# Altium project nvs.PrjPcb
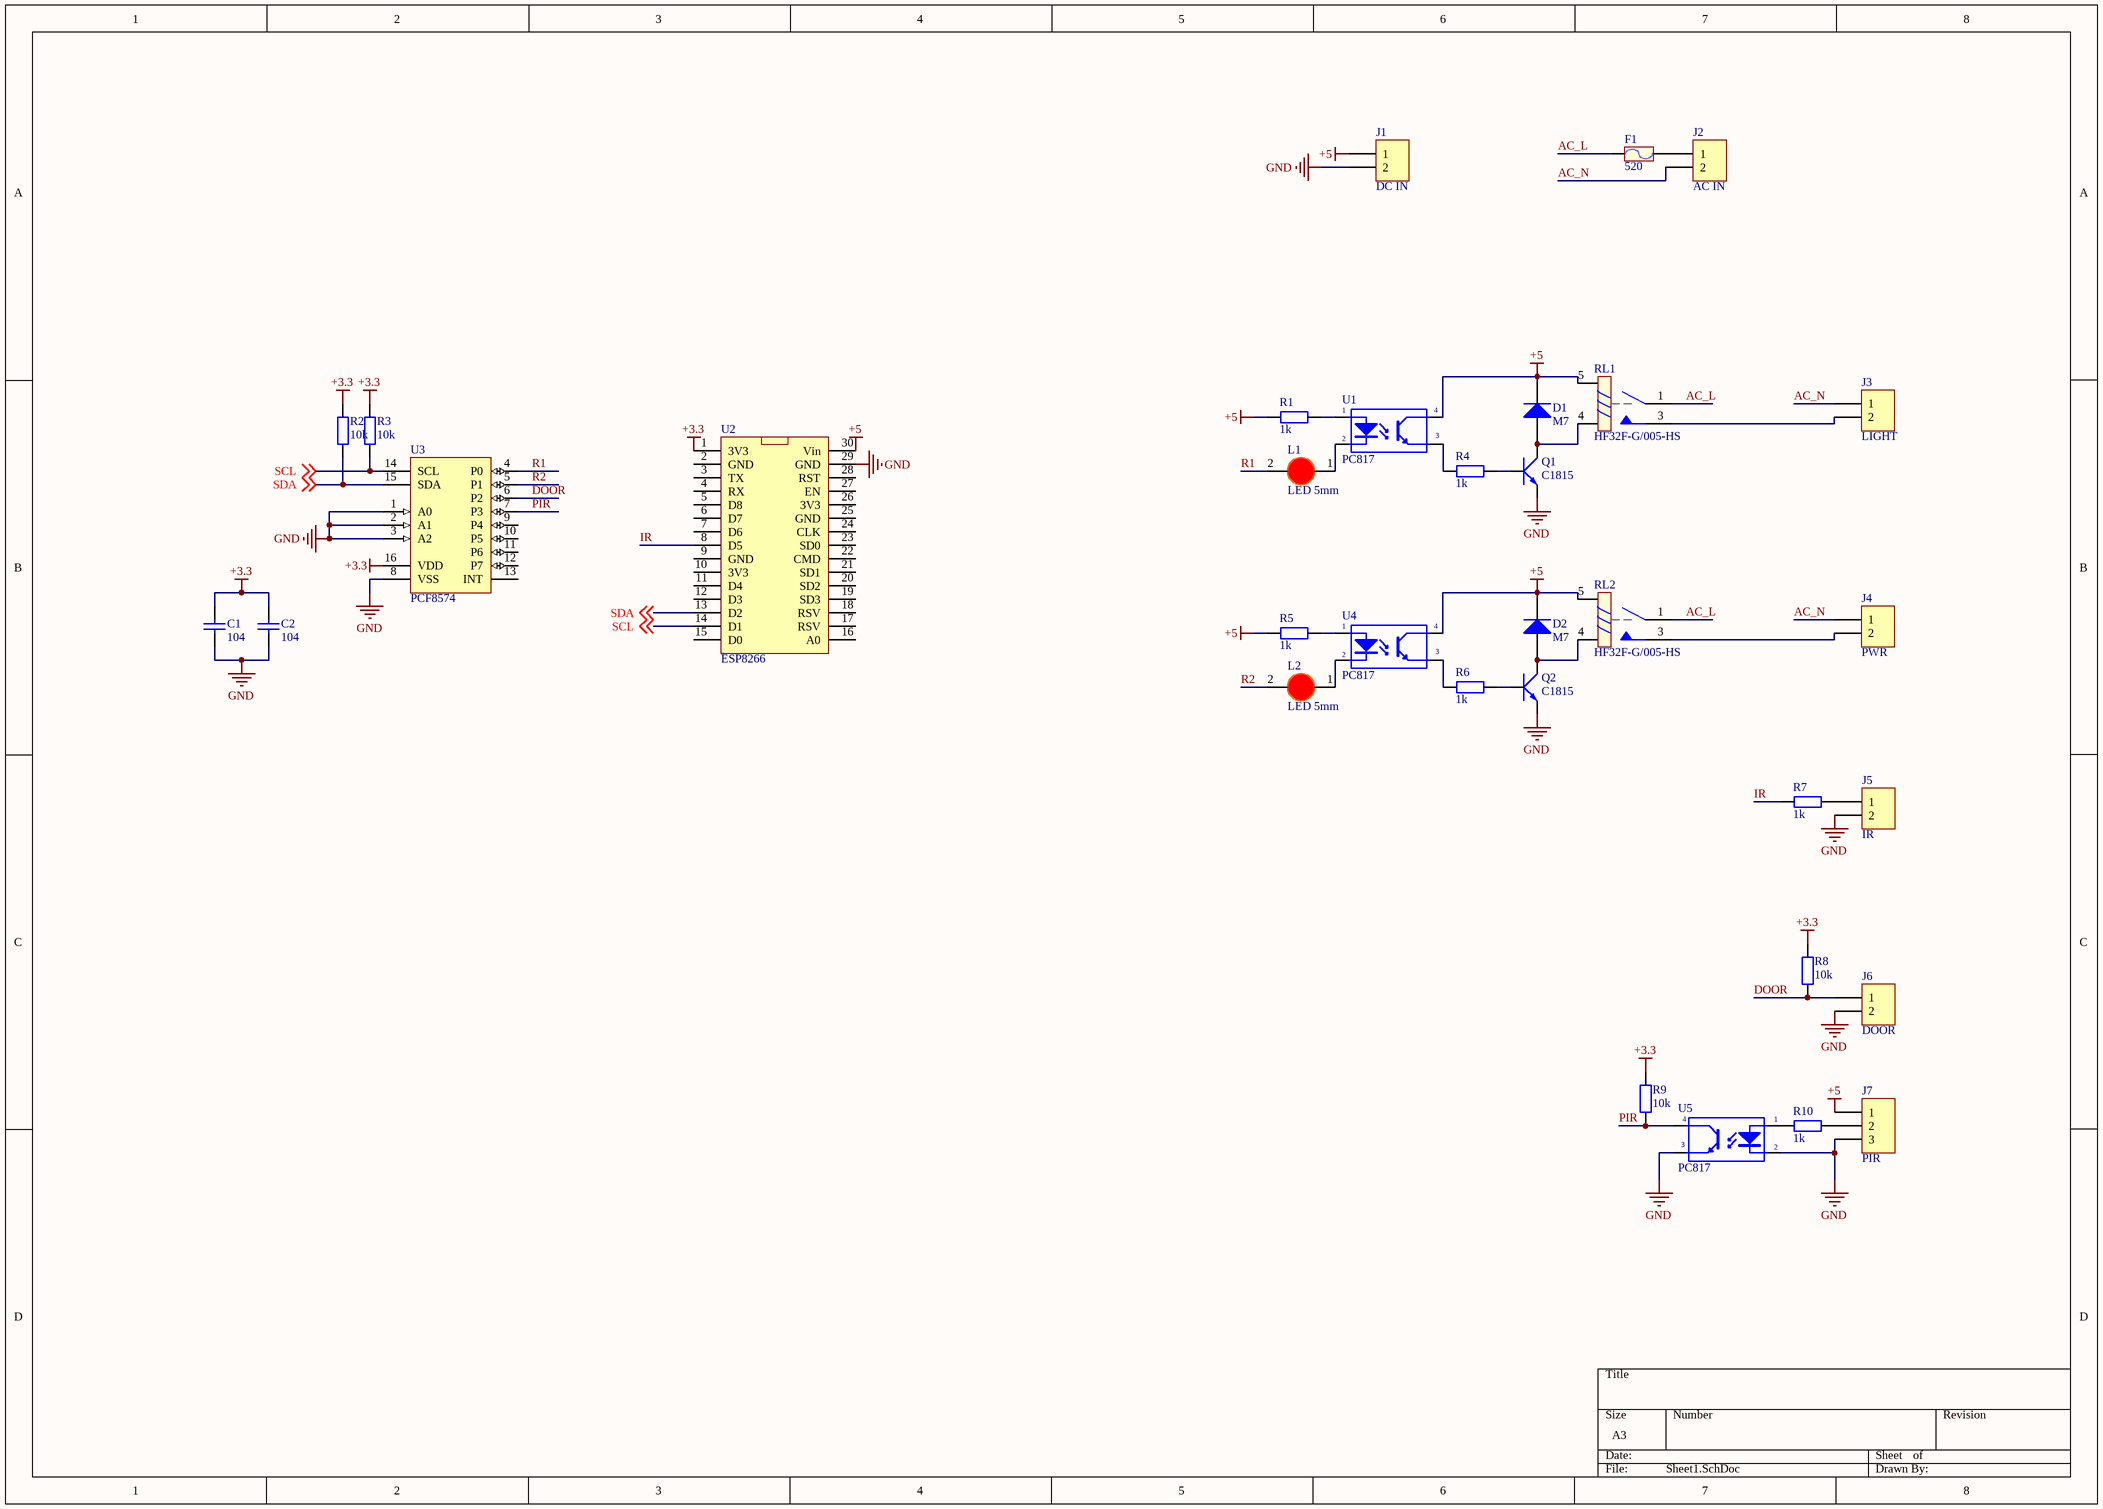
[diagram p0: Sheet1.SchDoc]
1 sheet, 33 parts. Net scope: global (net labels, ports and power ports of the same name join across sheets).
Board file: PCB1.PcbDoc

## Sheet Sheet1.SchDoc
size A3; SheetNumber: 1; SheetTotal: 1

### Parts
C1  104  [tu 0805]
C2  104  [tu 0805]
D1  M7  [DIODE SMA]
D2  M7  [DIODE SMA]
F1  520  [De Cau Chi 520 630]
J1  DC IN  [CON 2 HT3.96]
J2  AC IN  [CON 2 2EDG5.08 B]
J3  LIGHT  [CON 2 2EDG5.08 B]
J4  PWR  [CON 2 2EDG5.08 B]
J5  IR  [CON 2 HT3.96]
J6  DOOR  [CON 2 HT3.96]
J7  PIR  [KF3-3.96]
L1  LED 5mm  [LED-5MM-RED]
L2  LED 5mm  [LED-5MM-RED]
Q1  C1815  [TO92]
Q2  C1815  [TO92]
R1  1k  [tro smd 0805]
R2  10k  [tro smd 0805]
R3  10k  [tro smd 0805]
R4  1k  [tro smd 0805]
R5  1k  [tro smd 0805]
R6  1k  [tro smd 0805]
R7  1k  [tro smd 0805]
R8  10k  [tro smd 0805]
R9  10k  [tro smd 0805]
R10  1k  [tro smd 0805]
RL1  HF32F-G/005-HS  [HF32F-G]
RL2  HF32F-G/005-HS  [HF32F-G]
U1  PC817  [DIP4]
U2  ESP8266  [NODE MCU CH340]
U3  PCF8574  [DIP16]
U4  PC817  [DIP4]
U5  PC817  [DIP4]

### Nets
+3.3: C1.1 C2.1 R2.2 R3.2 R8.2 R9.2 U2.1(3V3) U3.16(VDD)
+5: D1.2(K) D2.2(K) J1.1 J7.1 R1.1 R5.1 RL1.5 RL2.5 U1.4(C) U2.30(Vin) U4.4(C)
GND: C1.2 C2.2 J1.2 J5.2 J6.2 J7.3 Q1.1(E) Q2.1(E) U2.29(GND) U3.1(A0) U3.2(A1) U3.3(A2) U3.8(VSS) U5.2(K) U5.3(E)
AC_L: F1.1 RL1.1 RL2.1
AC_N: J2.2 J3.1 J4.1
DOOR: J6.1 R8.1 U3.6(P2)
IR: R7.1 U2.8(D5)
PIR: R9.1 U3.7(P3) U5.4(C)
R1: L1.2(K) U3.4(P0)
R2: L2.2(K) U3.5(P1)
SCL: R3.1 U2.14(D1) U3.14(SCL) ; off-sheet SCL
SDA: R2.1 U2.13(D2) U3.15(SDA) ; off-sheet SDA
NetD1_1: D1.1(A) Q1.2(C) RL1.4
NetD2_1: D2.1(A) Q2.2(C) RL2.4
NetF1_2: F1.2 J2.1
NetJ3_2: J3.2 RL1.3
NetJ4_2: J4.2 RL2.3
NetJ5_1: J5.1 R7.2
NetJ7_2: J7.2 R10.1
NetL1_1: L1.1(A) U1.2(K)
NetL2_1: L2.1(A) U4.2(K)
NetQ1_3: Q1.3(B) R4.2
NetQ2_3: Q2.3(B) R6.2
NetR1_2: R1.2 U1.1(A)
NetR4_1: R4.1 U1.3(E)
NetR5_2: R5.2 U4.1(A)
NetR6_1: R6.1 U4.3(E)
NetR10_2: R10.2 U5.1(A)

Not connected (* = marked no-connect by the designer): U2 2(GND) 3(TX) 4(RX) 5(D8) 6(D7) 7(D6) 9(GND) 10(3V3) 11(D4) 12(D3) 15(D0) 16(A0) 17(RSV) 18(RSV) 19(SD3) 20(SD2) 21(SD1) 22(CMD) 23(SD0) 24(CLK) 25(GND) 26(3V3) 27(EN) 28(RST); U3 9(P4) 10(P5) 11(P6) 12(P7) 13(INT)

### Library data of the parts
C1 C2 = Tu 0805 104 50V 10%: Dán; Don_Vi: Con; So_Chan: 2; Ten_Linh_Kien: Tụ 0805 104-100nF 10% 50V; Ma_Hang: MH004551; Chung_Loai: Dán; Kieu_Chan: *
D1 D2 = Diode M7 ( 4007 ): Dán; Ten_Linh_Kien: Diode M7 1N4007 SMD 1A 1000V; Don_Vi: Con; Ma_Hang: MH000944; Chung_Loai: Dán; Ghi_Chu: *
F1 = De Cau Chi 520 630: 5x20mm; Ma_Hang: MH001473; Ten: Đế Cầu Chì 5x20MM 6x30MM SMD01
J1-J6 = CON 2 EDG5.08: CON2 KF terminal
J7 = CON 3 EDG: CON3 KF terminal
L1 L2 = LED 5mm Do: Cắm; Don_Vi: Con; Ma_Hang: MH008967; Ten_Linh_Kien: Led 5MM Phủ Đỏ (1000c); Ghi_Chu: *; Kieu_Chan: *; Chung_Loai: Cắm
Q1 Q2 = Trans C1815 DIP: NPN transistor; Value: C9014
R1 R4-R7 R10 = Tro 0805 1% 1k: Dán; Don_Vi: Con; So_Chan: 2; Ten_Linh_Kien: Trở 0805 1% 1k; Ma_Hang: MH005468; Chung_Loai: Dán; Kieu_Chan: *
R2 R3 R8 R9 = Tro 0805 1% 10k: Dán; Don_Vi: Con; So_Chan: 2; Ten_Linh_Kien: Trở 0805 1% 10k; Ma_Hang: MH005473; Chung_Loai: Dán; Kieu_Chan: *
RL1 RL2 = Relay HF 10A: Relay hongfa 10A 4P HF32F-G/005-HS
U1 U4 U5 = PC817: Single Opto; Value: PC817
U2 = NODEMCU 1.0: ESP8266 nodemcu 1.0